# EAGLE design esp12-1-1 (EAGLE 7.1.0)
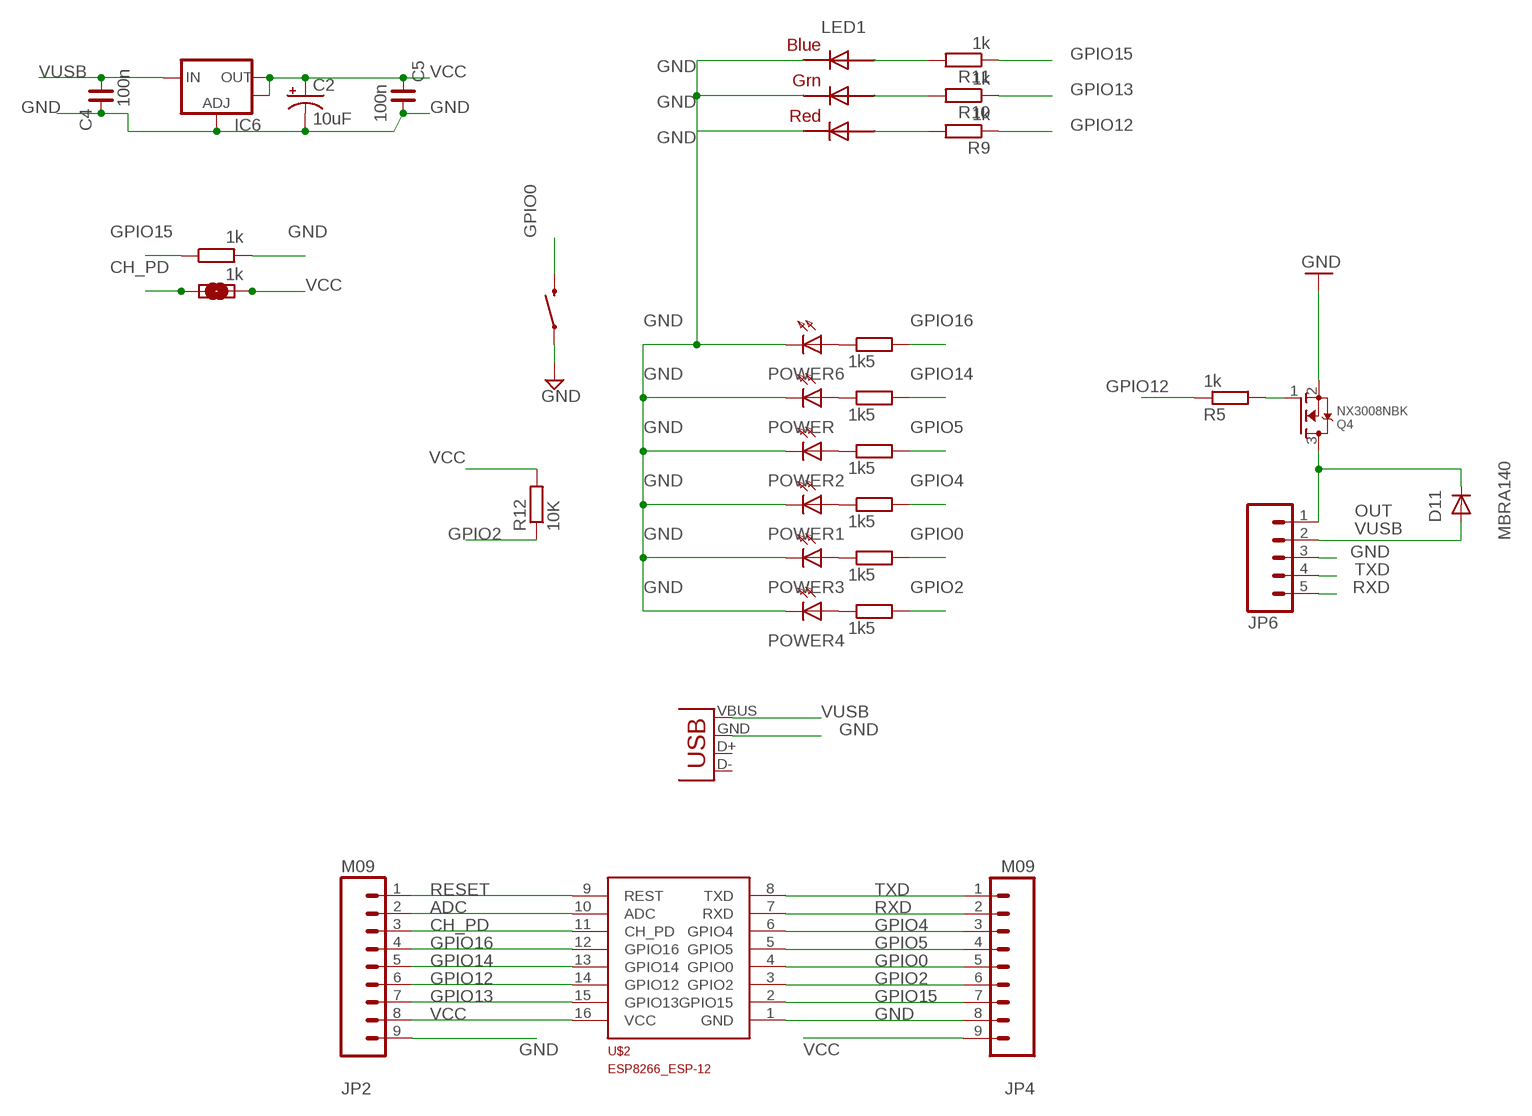
[diagram p0: schematic, sheet 1]

## Parts
C2  10uF  CAP_POL1206  [EIA3216]
C4  100n  C_0603  [C0603]
C5  100n  C_0603  [C0603]
D11  MBRA140  DIODESOD  [SOD-323]
IC6  V_REG_LM1117SOT223  [SOT223]
JP2  M09  [1X09]
JP4  M09  [1X09]
JP6  M05NO_SILK  [1X05_NO_SILK]
LED1  RGBLED5050  [RGBLED5050]
POWER  NA  LED0603DWS  [LED-0603]
POWER1  NA  LED0603DWS  [LED-0603]
POWER2  NA  LED0603DWS  [LED-0603]
POWER3  NA  LED0603DWS  [LED-0603]
POWER4  NA  LED0603DWS  [LED-0603]
POWER6  NA  LED0603DWS  [LED-0603]
PWR2  SOLDERJUMPERNO  [SJ_2S-NO]
Q4  NX3008NBK  MOSFET-NWIDE  [SOT23-WIDE]
R1  1k5  R-EU_R0603  [R0603]
R2  1k5  R-EU_R0603  [R0603]
R3  1k5  R-EU_R0603  [R0603]
R4  1k5  R-EU_R0603  [R0603]
R5  1k  R-EU_R0603  [R0603]
R6  1k5  R-EU_R0603  [R0603]
R7  1k  R-EU_R0603  [R0603]
R8  1k  R-EU_R0603  [R0603]
R9  1k  R-EU_R0603  [R0603]
R10  1k  R-EU_R0603  [R0603]
R11  1k  R-EU_R0603  [R0603]
R12  10K  R-EU_R0603  [R0603]
R13  1k5  R-EU_R0603  [R0603]
RESET1  SWITCH-MOMENTARY-2-SMD-1101NE  [TACTILE-SWITCH-1101NE]
U$2  ESP8266_ESP-12  [ESP8266-ESP12]
X3  USB-A-H  [USB-A-H]

## Nets
ADC: JP2.2 U$2.10(ADC)
CH_PD: JP2.3 PWR2.1 R8.2 U$2.11(CH_PD)
GND: C2.C(-) C4.2 C5.1 IC6.1(ADJ) JP2.9 JP4.8 JP6.3 LED1.4(BLUE_C) LED1.5(RED_C) LED1.6(GREEN_C) POWER1.C POWER2.C POWER3.C POWER4.C POWER6.C POWER.C Q4.2(S) R7.2 RESET1.P$1 U$2.1(GND) X3.GND(VBUS)
GPIO0: JP4.5 R3.2 RESET1.P$2 U$2.4(GPIO0)
GPIO2: JP4.6 R4.2 R12.1 U$2.3(GPIO2)
GPIO4: JP4.3 R1.2 U$2.6(GPIO4)
GPIO5: JP4.4 R2.2 U$2.5(GPIO5)
GPIO12: JP2.6 R5.1 R9.1 U$2.14(GPIO12)
GPIO13: JP2.7 R10.1 U$2.15(GPIO13)
GPIO13X: LED1.2(RED_A) R9.2
GPIO14: JP2.5 R13.2 U$2.13(GPIO14)
GPIO15: JP4.7 R7.1 R11.1 U$2.2(GPIO15)
GPIO16: JP2.4 R6.2 U$2.12(GPIO16)
N$1: POWER1.A R1.1
N$2: POWER2.A R2.1
N$3: POWER3.A R3.1
N$4: POWER4.A R4.1
N$5: Q4.1(G) R5.2
N$6: POWER6.A R6.1
N$8: LED1.3(BLUE_A) R11.2
N$9: LED1.1(GREEN_A) R10.2
N$14: POWER.A R13.1
OUT: D11.1(C) JP6.1 Q4.3(D)
RESET: JP2.1 U$2.9(REST)
RXD: JP4.2 JP6.5 U$2.7(RXD)
TXD: JP4.1 JP6.4 U$2.8(TXD)
VCC: C2.A(+) C5.2 IC6.2(OUT) IC6.4(OUT) JP2.8 JP4.9 PWR2.2 R8.1 R12.2 U$2.16(VCC)
VUSB: C4.1 D11.2(A) IC6.3(IN) JP6.2 X3.VBUS(GND)
Unconnected: X3.D+(D-) X3.D-(D+)

## Library data of the parts
C2 = SparkFun:CAP_POL: Capacitor Polarized These are standard SMD and PTH capacitors. Normally 10uF, 47uF, and 100uF in electrolytic and tantalum varieties. Always verify the external diameter of the through hole cap, it varies with capacity, voltage, and manufacturer. The EIA devices should be standard.
C4 C5 = rc-master-smd:C_: NON-POLARIZED CAP
D11 = SparkFun:DIODE: Diode These are standard reverse protection diodes and small signal diodes. SMA package can handle up to about 1A. SOD-323 can handle about 200mA. What the SOD-323 package when ordering, there are some mfgs out there that are 5-pin packages.
IC6 = SparkFun:V_REG_LM1117: Voltage Regulator LM1117 Standard adjustable voltage regulator but in SMD form. Spark Fun Electronics SKU : COM-00595
JP2 JP4 = SparkFun-Connectors:M09: Header 9 Standard 9-pin 0.1" header. Use with straight break away headers (SKU : PRT-00116), right angle break away headers (PRT-00553), swiss pins (PRT-00743), machine pins (PRT-00117), and female headers (PRT-00115).
JP6 = SparkFun-Connectors:M05: Header 5 Standard 5-pin 0.1" header. Use with straight break away headers (SKU : PRT-00116), right angle break away headers (PRT-00553), swiss pins (PRT-00743), machine pins (PRT-00117), and female headers (PRT-00115). Molex polarized connector foot print use with SKU : PRT-08230 with associated crimp pins and housings.
LED1 = adafruit:RGBLED: For 5050 RGB LEDs, the order of the LEDs may vary from one manufacturer to another!
POWER POWER1-POWER4 POWER6 = DOUBLE-SIDE:LED
PWR2 = SparkFun:SOLDERJUMPER: Solder Jumper Standard SMD solder jumper. Used to automate production. Two varients : Normally Open and Normally Closed are the same, but have different paste layers. NC will have a large amount of paste and should jumper during reflow.
Q4 = microbuilder:MOSFET-N: N-Channel Mosfet LEGEND VDS: Voltage Drain-Source ID: Drain Current RDS(ON): Drain-Source On-State Resistance VGS(TH): Gate-Source Threshold Voltage CISS: Drain-Source Input Capacitance SOT-23 Name VDS ID RDS(ON) VGS(TH) CISS Order Number 2N7002E 60V 260mA 2.5 Ohm 2.5V @ 250uA 26.7pF @ 25V 2N7002ET1GOSTR-ND BSH103 30V 850mA 400 mOhm 400mV @ 1mA 83pF @ 24V BSH103,235-ND BSS138 60V 320mA 1.6 Ohm 1.5V @ 250uA 50pF @ 10V Mouser: 771-BSS138PW115 DMN2075U-7 20V 4.2A 38 mOhm 1V @ 250 uA 594.3pF @ 10V DMN2075U-7DICT-ND * BSS138 good choice for I2C level-shifting
R1-R11 R13 = resistor:R-EU_: RESISTOR, European symbol
R12 = rcl:R-EU_: RESISTOR, European symbol
RESET1 = SparkFun:SWITCH-MOMENTARY-2
U$2 = ESP8266-ESP12:ESP8266_ESP-12
X3 = SparkFun:USB: USB Connectors USB-B-PTH is fully proven SKU : PRT-00139 USB-miniB is fully proven SKU : PRT-00587 USB-A-PCB is untested. USB-A-H is throughly reviewed, but untested. Spark Fun Electronics SKU : PRT-00437 USB-B-SMT is throughly reviewed, but untested. Needs silkscreen touching up. USB-A-S has not been used/tested USB-MB-H has not been used/tested

## Net classes
0 default: width 0.229 mm, drill 0.381 mm, clearance 0.229 mm
1 GND: width 0.229 mm, drill 0.381 mm, clearance 0.229 mm
2 pwr: width 0.229 mm, drill 0.381 mm, clearance 0.229 mm

## Board
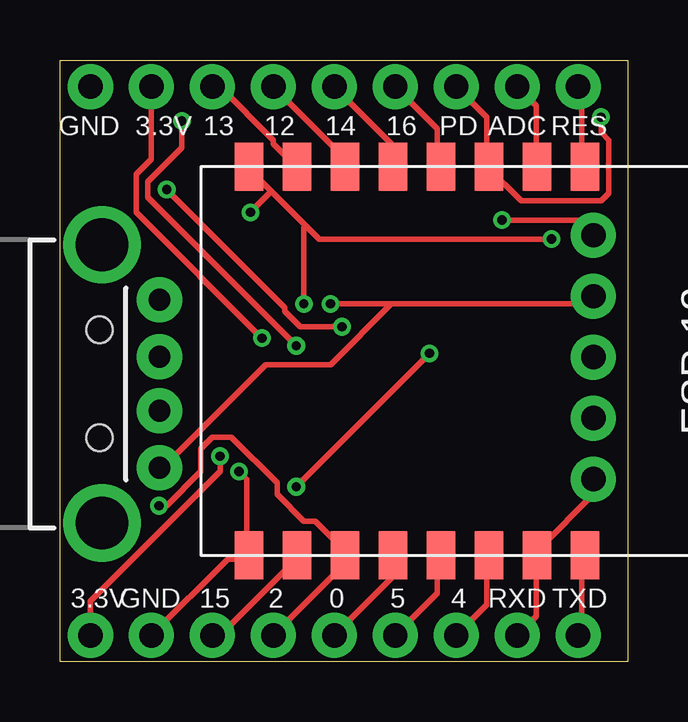
[diagram p1: board, top side]
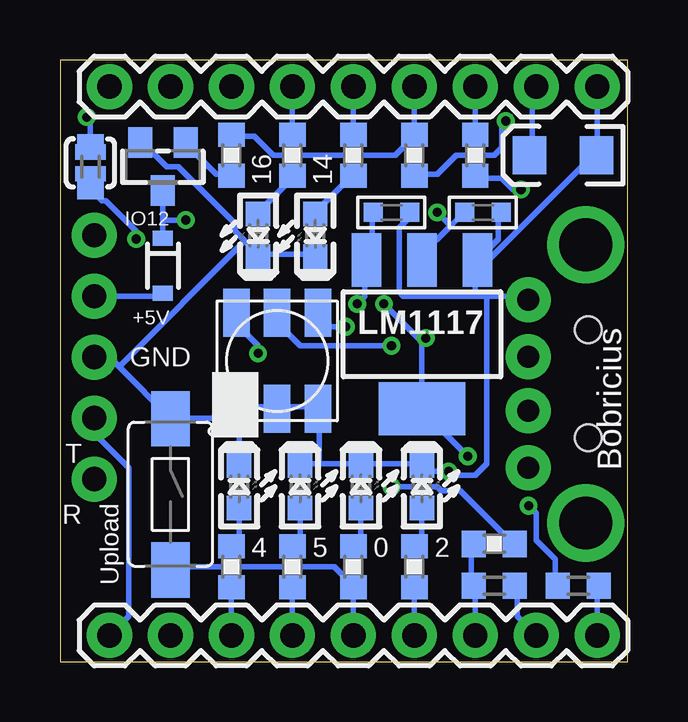
[diagram p2: board, bottom side, seen from below]

Size 23.65 x 25.08 mm. Coordinates in mm from the lower left corner, seen from the top.
Outline: 0,25.08 23.65,25.08 23.65,0 0,0 0,25.08
Copper layers (1*16): Top 0.0356mm / dielectric 1.5011mm / Bottom 0.0356mm
Design rules "LaenPCBOrder (1) *": minimum track width 6mil, minimum drill 13mil, track to track 8mil, track to pad 8mil, pad to pad 8mil, via to via 8mil, smd to smd 6mil, copper to edge 15mil, drill to drill 6mil, minimum pad ring 7mil, minimum via ring 7mil, stop-mask expansion 4mil, vias tented up to drill 30mil, thermal gap 10mil

### Footprints (pad centres in the part's own frame; a part is rotated, then mirrored left to right if it is on the bottom)
EIA3216 = smd 1.4 x 1.6: A 1.4,0; C -1.4,0
C0603 = smd 0.8 x 0.8: 1 -0.762,0; 2 0.762,0
SOD-323 = smd 0.63 x 0.83: 1 -1.15,0; 2 1.15,0
SOT223 = smd 1.219 x 2.235: 1 -2.311,-3.099; 2 0,-3.099; 3 2.311,-3.099 | smd 3.6 x 2.2: 4 0,3.099
1X09 = drill 1.016 pad 1.88: 1 0,0; 2 2.54,0; 3 5.08,0; 4 7.62,0; 5 10.16,0; 6 12.7,0; 7 15.24,0; 8 17.78,0; 9 20.32,0
1X05_NO_SILK = drill 1.016 pad 1.88: 1 0,0; 2 2.54,0; 3 5.08,0; 4 7.62,0; 5 10.16,0
RGBLED5050 = smd 2 x 1.1: 1 -2,1.7; 2 -2,0; 3 -2,-1.7; 4 2,-1.7; 5 2,0; 6 2,1.7
LED-0603 = smd 1.016 x 1.016: A 0.889,0; C -0.889,0
SJ_2S-NO = smd 0.635 x 1.27: 1 -0.45,0; 2 0.45,0
SOT23-WIDE = smd 1 x 1.27: 1 -0.95,-1; 2 0.95,-1; 3 0,1
R0603 = smd 1 x 1.1: 1 -0.85,0; 2 0.85,0
TACTILE-SWITCH-1101NE = smd 2.3 x 1.6: P$1 -3.15,0; P$2 3.15,0
ESP8266-ESP12 = smd 2 x 1.2: 1 16.2,2; 2 16.2,4; 3 16.2,6; 4 16.2,8; 5 16.2,10; 6 16.2,12; 7 16.2,14; 8 16.2,16; 9 0,16; 10 0,14; 11 0,12; 12 0,10; 13 0,8; 14 0,6; 15 0,4; 16 0,2
USB-A-H = drill 0.914 pad 1.88: D+ 2.4,1.127; D- 2.4,-1.127; GND 2.4,3.5; VBUS 2.4,-3.5 | drill 2.2: GND2 0,-5.8; GND3 0,5.8 | hole 1.1: -0.1,2.25; -0.1,-2.25

### Placement (x,y rotation side)
C2  2.7,21.11 180 bottom
C4  9.84,18.73 0 bottom
C5  6.03,18.73 180 bottom
D11  19.37,16.51 270 bottom
IC6  8.57,13.65 180 bottom
JP2  21.59,23.97 0 bottom
JP4  21.59,1.11 0 bottom
JP6  22.23,17.78 270 top
LED1  14.6,12.54 270 bottom
POWER  13.02,17.78 90 bottom
POWER1  16.19,7.3 270 bottom
POWER2  13.65,7.3 270 bottom
POWER3  11.11,7.3 270 bottom
POWER4  8.57,7.3 270 bottom
POWER6  15.4,17.78 90 bottom
PWR2  22.38,20.8 270 bottom
Q4  19.37,20.64 180 bottom
R1  16.51,3.97 270 bottom
R2  13.97,3.97 270 bottom
R3  11.43,3.97 270 bottom
R4  8.89,3.97 270 bottom
R5  16.51,21.11 270 bottom
R6  13.97,21.11 90 bottom
R7  5.56,3.18 0 bottom
R8  22.38,20.64 90 bottom
R9  8.89,21.11 270 bottom
R10  6.35,21.11 270 bottom
R11  5.56,4.92 0 bottom
R12  2.06,3.18 0 bottom
R13  11.43,21.11 90 bottom
RESET1  19.05,6.99 270 bottom
U$2  5.87,20.64 270 top
X3  1.75,11.59 0 top

### Tracks (layer width: path | path; a pad name or v marks a point on that pad's centre or on a via)
ADC
  Top 0.229: JP2.2 19.84,23.18 19.84,20.64 U$2.10
CH_PD  (via drill 0.38)
  Top 0.229: v22.54,22.7 22.54,22.07 22.86,21.75 22.86,19.53 22.54,19.21 19.21,19.21 17.78,20.64 | 17.78,20.64 17.78,22.7 JP2.3 | 17.78,20.64 U$2.11
  Bottom 0.229: PWR2.1 R8.2 22.38,22.54 v22.54,22.7
GND  (via drill 0.38)
  Top 0.229: JP4.8 6.98,4.29 7.78,4.29 U$2.1 7.78,4.44 7.78,7.62 v7.46,7.94
  Bottom 0.229: JP2.9 1.27,21.11 C2.C 1.43,21.11 6.35,16.19 | C5.1 5.4,18.73 5.4,17.62 6.19,16.83 IC6.1 | 5.87,15.24 4.29,15.24 X3.GND | 5.87,15.24 6.35,15.24 | 6.35,15.24 9.37,15.24 9.53,15.4 9.53,18.1 9.21,18.41 9.21,18.73 C4.2 | 6.35,15.24 6.35,16.19 | 6.35,16.19 6.35,16.67 IC6.1 | 6.35,16.19 IC6.1 | JP4.8 4.6,1.9 4.6,3.17 R7.2 | 15.4,16.99 13.02,16.99 POWER.C | 15.4,16.99 15.95,17.54 | 15.95,17.54 16.35,17.94 16.35,18.26 18.73,20.64 19.21,20.64 20.16,21.59 Q4.2 | 15.4,16.99 POWER6.C | 11.11,8.25 8.57,8.25 POWER4.C 8.57,8.1 8.41,7.94 v7.46,7.94 7.3,7.78 6.35,7.78 5.87,8.25 5.87,15.24 | 11.11,8.25 12.86,8.25 | 12.86,8.25 13.65,8.25 POWER2.C | 11.11,8.25 POWER3.C | 14.6,10.64 13.02,10.64 LED1.6 12.86,10.48 12.86,8.25 | 16.19,10.16 16.19,10.48 LED1.4 | 16.19,10.16 POWER1.C | 16.19,10.16 19.05,10.16 | 16.19,10.16 LED1.4 | 14.6,10.64 16.19,10.64 LED1.4 | 14.6,10.64 LED1.5 | JP6.3 21.59,12.7 21.19,12.3 | 19.05,10.16 21.19,12.3 | 19.05,10.16 RESET1.P$1 | 21.19,12.3 15.95,17.54
GPIO0
  Top 0.229: JP4.5 13.81,3.49 13.81,4.29 U$2.4
  Bottom 0.229: JP4.5 R3.2 11.43,3.17 12.22,3.97 19.05,3.97 RESET1.P$2
GPIO2  (via drill 0.38)
  Top 0.229: v4.13,6.51 4.44,6.51 5.87,7.94 5.87,8.89 6.35,9.37 7.14,9.37 9.05,7.46 9.05,6.98 10.16,5.87 10.64,5.87 11.75,4.76 11.75,4.44 U$2.3 11.75,4.29 11.75,3.97 JP4.6
  Bottom 0.229: JP4.6 R4.2 | v4.13,6.51 3.81,6.19 3.81,5.08 3.02,4.29 3.02,3.17 R12.1
GPIO4
  Top 0.229: JP4.3 17.78,2.38 17.78,4.29 U$2.6
  Bottom 0.229: JP4.3 R1.2
GPIO5
  Top 0.229: JP4.4 15.72,2.86 15.72,4.29 U$2.5
  Bottom 0.229: JP4.4 R2.2
GPIO12
  Top 0.229: JP2.6 11.75,21.11 11.75,20.64 U$2.14
  Bottom 0.229: JP2.6 R9.1 8.89,21.91 9.68,21.11 14.76,21.11 15.56,21.91 16.51,21.91 R5.1
GPIO13
  Top 0.229: JP2.7 6.67,23.97 8.89,21.75 8.89,21.59 9.84,20.64 U$2.15
  Bottom 0.229: JP2.7 R10.1
GPIO13X  (via drill 0.38)
  Top 0.229: v5.08,22.54 5.08,21.43 3.65,20 3.65,19.37 v9.84,13.18
  Bottom 0.229: v5.08,22.54 5.24,22.38 5.24,21.43 5.56,21.11 7.14,21.11 7.94,20.32 8.89,20.32 R9.2 | v9.84,13.18 13.65,13.18 14.6,14.13 LED1.2
GPIO14
  Top 0.229: JP2.5 13.81,21.59 13.81,20.64 U$2.13
  Bottom 0.229: JP2.5 R13.2
GPIO15
  Top 0.229: JP4.7 6.67,1.11 9.84,4.29 U$2.2
  Bottom 0.229: R11.1 6.51,4.92 6.51,3.17 R7.1 6.35,3.17 JP4.7
GPIO16
  Top 0.229: JP2.4 15.72,22.22 15.72,20.64 U$2.12
  Bottom 0.229: JP2.4 R6.2
N$1
  Bottom 0.229: POWER1.A 16.19,5.24 16.51,4.92 R1.1
N$2
  Bottom 0.229: POWER2.A 13.65,5.24 13.97,4.92 R2.1
N$3
  Bottom 0.229: 11.11,6.51 POWER3.A 11.11,5.24 11.43,4.92 R3.1
N$4
  Bottom 0.229: 8.57,6.51 POWER4.A 8.57,5.24 8.89,4.92 R4.1
N$5
  Bottom 0.229: R5.2 16.51,20.32 17.14,20.32 18.41,21.59 Q4.1
N$6
  Bottom 0.229: POWER6.A 15.4,18.73 13.97,20.16 R6.1
N$8  (via drill 0.38)
  Top 0.229: v15.4,12.86 v9.84,7.3
  Bottom 0.229: v9.84,7.3 7.94,7.3 7.78,7.14 6.98,7.14 4.76,4.92 R11.2 | v15.4,12.86 15.4,13.18 16.19,13.97 16.19,14.45 LED1.3
N$9  (via drill 0.38)
  Top 0.229: v4.44,19.68 9.37,14.76 9.37,14.6 10,13.97 v11.75,13.97
  Bottom 0.229: v4.44,19.68 4.76,19.68 5.24,20.16 6.35,20.16 R10.2 | v11.75,13.97 12.38,13.97 12.86,14.45 LED1.1
N$14
  Bottom 0.229: POWER.A 13.02,18.73 11.43,20.32 R13.1
OUT  (via drill 0.38)
  Top 0.229: v18.41,18.41 21.59,18.41 JP6.1
  Bottom 0.229: Q4.3 19.37,18.41 | 19.37,18.41 D11.1 | v18.41,18.41 19.37,18.41
RESET
  Top 0.229: JP2.1 21.75,23.81 21.75,20.64 U$2.9
RXD
  Top 0.229: JP4.2 19.84,1.9 19.84,4.29 U$2.7 20,4.44 20,4.76 22.23,6.98 JP6.5
TXD
  Top 0.229: JP4.1 21.75,1.27 21.75,4.29 U$2.8
  Bottom 0.229: JP6.4 22.23,9.52 20.8,8.1 20.8,1.9 JP4.1
VCC  (via drill 0.38)
  Top 0.229: v20.48,17.62 10.79,17.62 10.24,18.18 | 8.81,19.61 7.78,20.64 U$2.16 | 8.81,19.61 10.24,18.18 | 8.81,19.61 v7.94,18.73 | v10.16,14.92 10.16,18.1 10.24,18.18 | JP4.9 1.27,2.54 6.67,7.94 v6.67,8.57 | JP2.8 3.81,20.95 3.17,20.32 3.17,18.73 v8.41,13.49
  Bottom 0.229: JP2.8 3.97,23.81 3.97,21.11 C2.A | JP4.9 1.27,3.17 R12.2 | 7.38,18.18 8.57,16.99 IC6.2 | 7.38,18.18 6.83,18.73 C5.2 | PWR2.2 R8.1 22.38,19.68 21.91,19.21 21.75,19.21 20.48,17.94 v20.48,17.62 | v7.94,18.73 7.38,18.18 | v10.16,14.92 8.65,13.41 | 8.65,13.41 8.57,13.33 IC6.4 8.57,10.48 v6.67,8.57 | v8.41,13.49 8.57,13.49 8.65,13.41
VUSB  (via drill 0.38)
  Top 0.229: 13.81,14.92 21.91,14.92 JP6.2 | 13.81,14.92 v11.27,14.92 | 13.81,14.92 11.27,12.38 8.57,12.38 4.29,8.1 X3.VBUS
  Bottom 0.229: C4.1 10.64,18.73 10.64,16.99 10.79,16.83 IC6.3 10.95,16.67 10.95,15.24 v11.27,14.92 | JP6.2 19.37,15.24 D11.2

### Text on the board
tNames: GND | 3.3V | 13 | 12 | 14 | 16 | PD | ADC | RES | 3.3V | GND | 15 | 2 | 0 | 5 | 4 | RXD | TXD
bNames: 14 | 16 | IO12 | +5V | LM1117 | GND | T | Bobricius | Upload | R | 2 | 0 | 5 | 4